# EAGLE design SerialChiller (EAGLE 9.1.3)
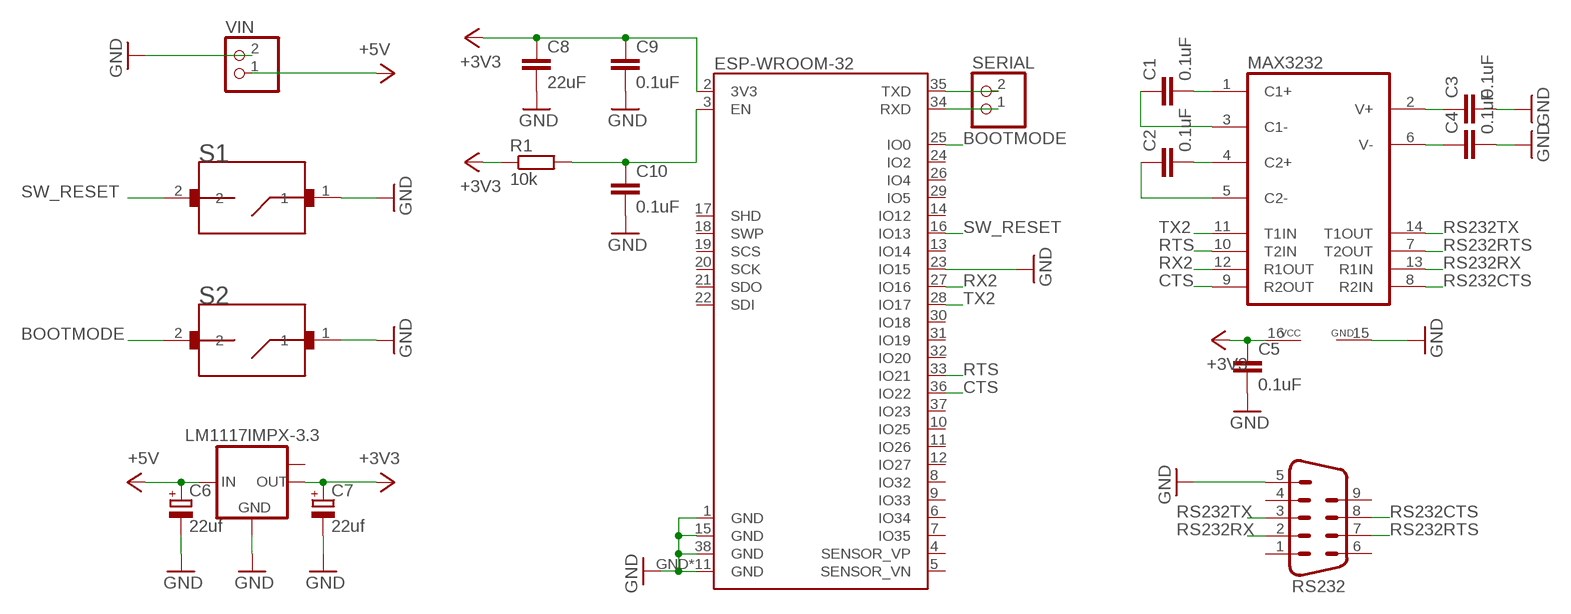
[diagram p0: schematic, sheet 1]

## Parts
C1  0.1uF  C-EUC0603  [C0603]
C2  0.1uF  C-EUC0603  [C0603]
C3  0.1uF  C-EUC0603  [C0603]
C4  0.1uF  C-EUC0603  [C0603]
C5  0.1uF  C-EUC0603  [C0603]
C6  22uf  CPOL-EUA/3216-18R  [A/3216-18R]
C7  22uf  CPOL-EUA/3216-18R  [A/3216-18R]
C8  22uF  C-EUC1206  [C1206]
C9  0.1uF  C-EUC0603  [C0603]
C10  0.1uF  C-EUC0603  [C0603]
ESP-WROOM-32  ESP-WROOM-03  [ESP-WROOM-03]
IC1  LM1117IMPX-3.3  [SOT223]
MAX3232  MAX3232CSE  [SO16]
R1  10k  R-EU_R0603  [R0603]
RS232  M09HP  [M09HP]
S1  B3U-1000P  [SW_B3U-1000P]
S2  B3U-1000P  [SW_B3U-1000P]
SERIAL  Serial  PINHD-1X2  [1X02]
VIN  Power  PINHD-1X2  [1X02]

## Nets
+3V3: C5.1 C7.+ C8.1 C9.1 ESP-WROOM-32.2(3V3) IC1.2(OUT) MAX3232.16(VCC) R1.1
+5V: C6.+ IC1.3(IN) VIN.1
BOOTMODE: ESP-WROOM-32.25(IO0) S2.2
C1+: C1.2 MAX3232.1(C1+)
C1-: C1.1 MAX3232.3(C1-)
C2+: C2.2 MAX3232.4(C2+)
C2-: C2.1 MAX3232.5(C2-)
CTS: ESP-WROOM-32.36(IO22) MAX3232.9(R2OUT)
ENABLE: C10.1 ESP-WROOM-32.3(EN) R1.2
GND: C3.2 C4.2 C5.2 C6.- C7.- C8.2 C9.2 C10.2 ESP-WROOM-32.1(GND) ESP-WROOM-32.15(GND) ESP-WROOM-32.23(IO15) ESP-WROOM-32.38(GND) ESP-WROOM-32.GND ESP-WROOM-32.GND1(GND) ESP-WROOM-32.P$1(GND) ESP-WROOM-32.P$2(GND) ESP-WROOM-32.P$3(GND) ESP-WROOM-32.P$4(GND) ESP-WROOM-32.P$5(GND) ESP-WROOM-32.P$6(GND) ESP-WROOM-32.P$7(GND) ESP-WROOM-32.P$8(GND) ESP-WROOM-32.P$9(GND) IC1.1(GND) MAX3232.15(GND) RS232.5 S1.1 S2.1 VIN.2
RS232CTS: MAX3232.8(R2IN) RS232.8
RS232RTS: MAX3232.7(T2OUT) RS232.7
RS232RX: MAX3232.13(R1IN) RS232.2
RS232TX: MAX3232.14(T1OUT) RS232.3
RTS: ESP-WROOM-32.33(IO21) MAX3232.10(T2IN)
RX1: ESP-WROOM-32.34(RXD) SERIAL.1
RX2: ESP-WROOM-32.27(IO16) MAX3232.12(R1OUT)
SW_RESET: ESP-WROOM-32.16(IO13) S1.2
TX1: ESP-WROOM-32.35(TXD) SERIAL.2
TX2: ESP-WROOM-32.28(IO17) MAX3232.11(T1IN)
VS+: C3.1 MAX3232.2(V+)
VS-: C4.1 MAX3232.6(V-)
Unconnected: ESP-WROOM-32.4(SENSOR_VP) ESP-WROOM-32.5(SENSOR_VN) ESP-WROOM-32.6(IO34) ESP-WROOM-32.7(IO35) ESP-WROOM-32.8(IO32) ESP-WROOM-32.9(IO33) ESP-WROOM-32.10(IO25) ESP-WROOM-32.11(IO26) ESP-WROOM-32.12(IO27) ESP-WROOM-32.13(IO14) ESP-WROOM-32.14(IO12) ESP-WROOM-32.17(SHD) ESP-WROOM-32.18(SWP) ESP-WROOM-32.19(SCS) ESP-WROOM-32.20(SCK) ESP-WROOM-32.21(SDO) ESP-WROOM-32.22(SDI) ESP-WROOM-32.24(IO2) ESP-WROOM-32.26(IO4) ESP-WROOM-32.29(IO5) ESP-WROOM-32.30(IO18) ESP-WROOM-32.31(IO19) ESP-WROOM-32.32(IO20) ESP-WROOM-32.37(IO23) IC1.TAB(OUT1) RS232.1 RS232.4 RS232.6 RS232.9

## Library data of the parts
C1-C5 C8-C10 = rcl:C-EU: CAPACITOR, European symbol
C6 C7 = rcl:CPOL-EU: POLARIZED CAPACITOR, European symbol
ESP-WROOM-32 = esp32:ESP-WROOM-03
IC1 = lm1117:LM1117IMPX-*
MAX3232 = maxim:MAX3232*: True RS-232 Transceivers 3.0V to 5.5V, Low-Power up to 1Mbps, Using Four 0.1µF External Capacitors Source: http://pdfserv.maxim-ic.com/en/ds/MAX3222-MAX3241.pdf; MPN: MAX3232CSE; OC_FARNELL: 9725490; OC_NEWARK: 90C2890
R1 = rcl:R-EU_: RESISTOR, European symbol
RS232 = 56F402-001:M09: SUB-D; OC_FARNELL: unknown; OC_NEWARK: unknown
S1 S2 = B3U-1000P:B3U-1000P: Switch Tactile N.O. SPST Round Button Gull Wing 0.05A 12VDC 1.5N SMD Embossed T/R; AVAILABILITY: Good; DESCRIPTION: Switch Tactile N.O. SPST Round Button Gull Wing 0.05A 12VDC 1.5N SMD Embossed T/R; MF: Omron; MP: B3U-1000P; PACKAGE: None; PRICE: 0.65 USD
SERIAL VIN = pinhead:PINHD-1X2: PIN HEADER

## Board
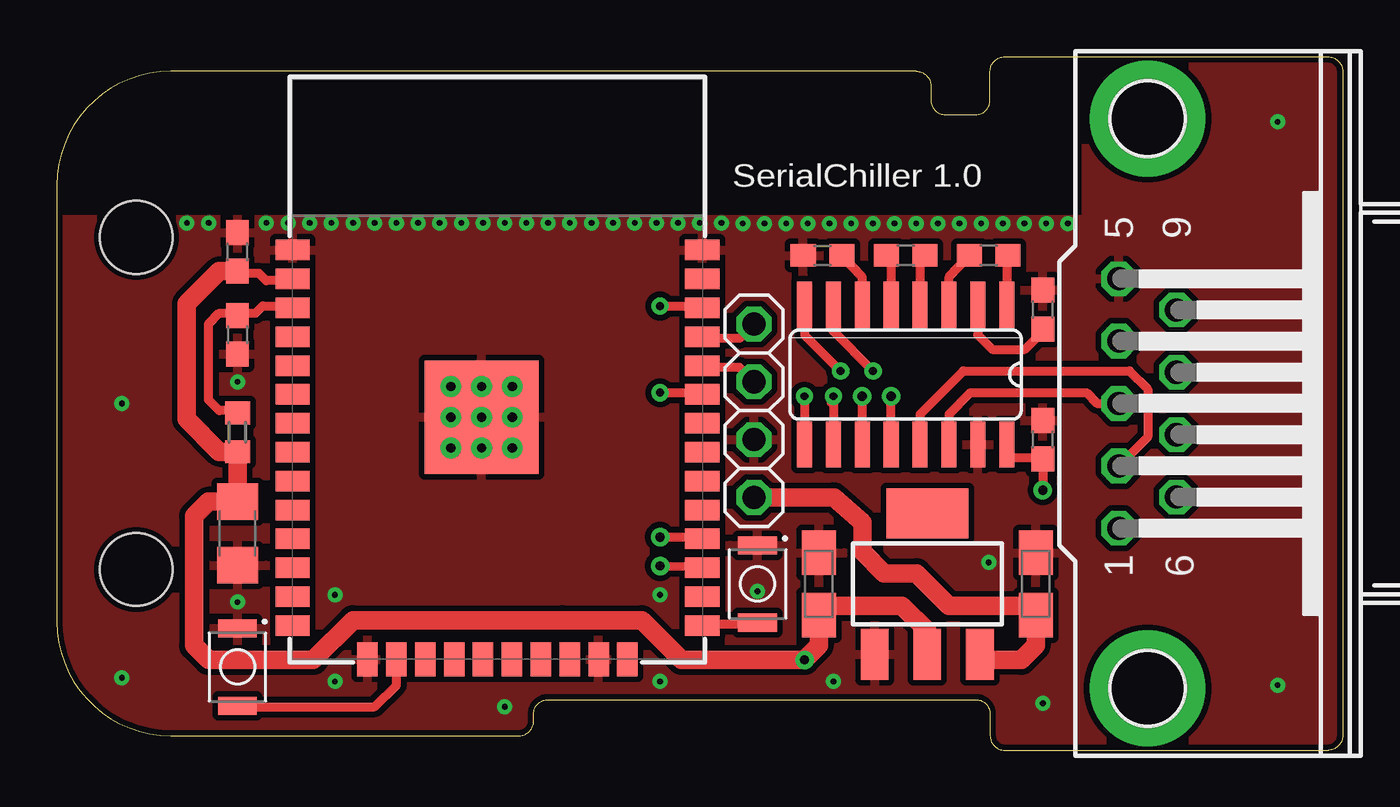
[diagram p1: board, top side]
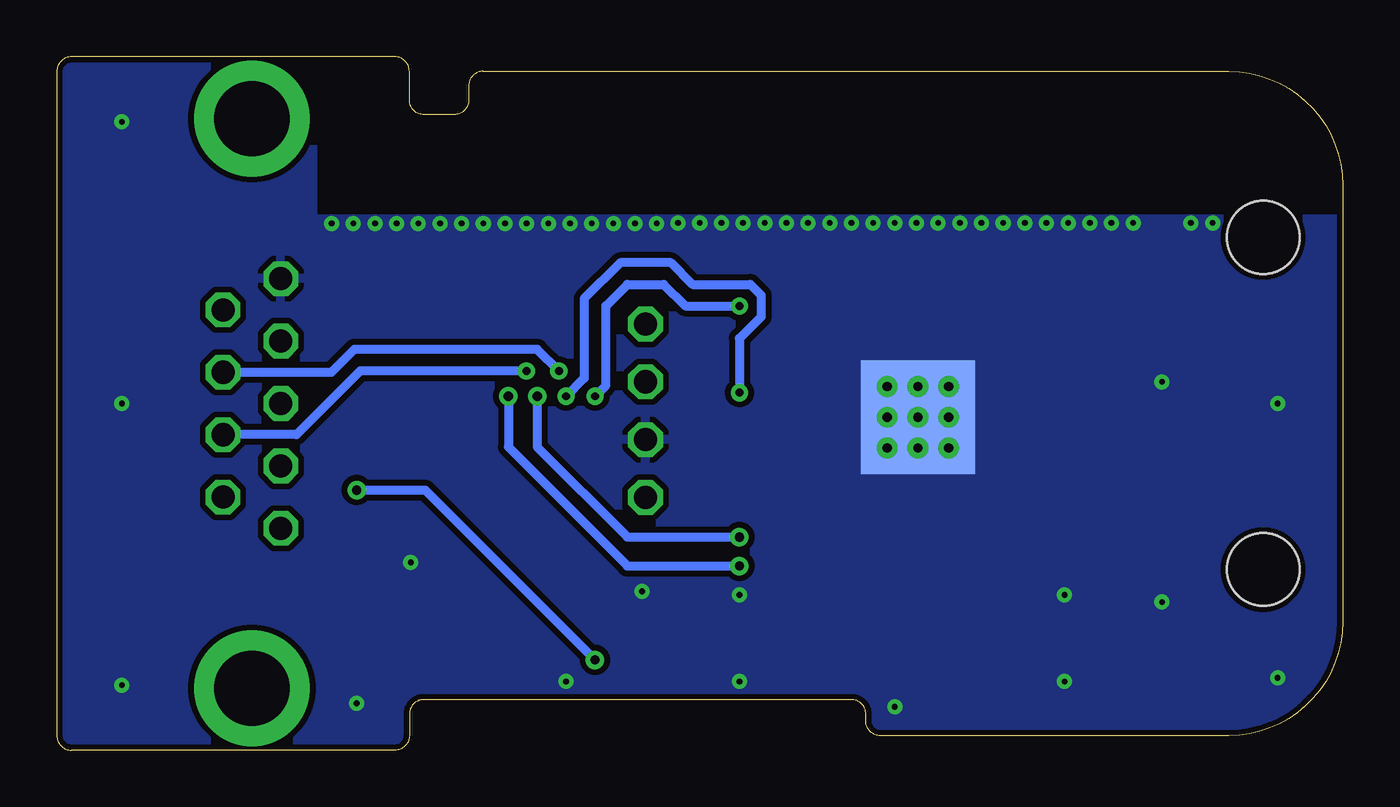
[diagram p2: board, bottom side, seen from below]

Size 56.51 x 30.48 mm. Coordinates in mm from the lower left corner, seen from the top.
Outline: 56.51,29.84 56.51,0.63 arc-90 55.88,0 41.66,0 arc-90 41.02,0.63 41.02,1.59 arc90 40.39,2.22 21.59,2.22 arc90 20.96,1.59 20.96,1.27 arc-90 20.32,0.63 5,0.63 arc-90 0,5.64 0,24.84 arc-90 5,29.84 37.78,29.84 arc-90 38.42,29.21 38.42,28.58 arc90 39.05,27.94 40.39,27.94 arc90 41.02,28.58 41.02,29.84 arc-90 41.66,30.48 55.88,30.48 arc-90 56.51,29.84
Copper layers (1*16): Top 0.035mm / dielectric 1.5mm / Bottom 0.035mm
Design rules "duinodcx *": minimum track width 10mil, minimum drill 10mil, track to track 10mil, track to pad 10mil, pad to pad 10mil, via to via 10mil, smd to smd 10mil, copper to edge 10mil, drill to drill 10mil, minimum pad ring 10mil, minimum via ring 8mil, stop-mask expansion 4mil, vias tented up to drill 16mil, thermal gap 10mil
Holes 3.2 mm at 3.49,22.54 3.49,7.94

### Footprints (pad centres in the part's own frame; a part is rotated, then mirrored left to right if it is on the bottom)
C0603 = smd 1.1 x 1: 1 -0.85,0; 2 0.85,0
A/3216-18R = smd 1.95 x 1.5: + 1.375,0; - -1.375,0
C1206 = smd 1.6 x 1.8: 1 -1.4,0; 2 1.4,0
ESP-WROOM-03 = smd 0.9 x 1.5: 1 7.7,9; 2 6.43,9; 3 5.16,9; 4 3.89,9; 5 2.62,9; 6 1.35,9; 7 0.08,9; 8 -1.19,9; 9 -2.46,9; 10 -3.73,9; 11 -5,9; 12 -6.27,9; 13 -7.54,9; 14 -8.81,9; 25 -8.81,-9; 26 -7.54,-9; 27 -6.27,-9; 28 -5,-9; 29 -3.73,-9; 30 -2.46,-9; 31 -1.19,-9; 32 0.08,-9; 33 1.35,-9; 34 2.62,-9; 35 3.89,-9; 36 5.16,-9; 37 6.43,-9; 38 7.7,-9 | smd 1.5 x 0.9: 15 -10.3,5.715; 16 -10.3,4.445; 17 -10.3,3.175; 18 -10.3,1.905; 19 -10.3,0.635; 20 -10.3,-0.635; 21 -10.3,-1.905; 22 -10.3,-3.175; 23 -10.3,-4.445; 24 -10.3,-5.715 | smd 5 x 5 bottom: GND 0.35,0.7 | smd 5 x 5: GND1 0.35,0.7 | drill 0.406: P$1 -1,2.05; P$2 0.35,2.05; P$3 1.7,2.05; P$4 -1,0.7; P$5 0.35,0.7; P$6 1.7,0.7; P$7 -1,-0.65; P$8 0.35,-0.65; P$9 1.7,-0.65
SOT223 = smd 1.219 x 2.235: 1 -2.311,-3.099; 2 0,-3.099; 3 2.311,-3.099 | smd 3.6 x 2.2: TAB 0,3.099
SO16 = smd 0.66 x 2.032: 1 -4.445,-3.073; 2 -3.175,-3.073; 3 -1.905,-3.073; 4 -0.635,-3.073; 5 0.635,-3.073; 6 1.905,-3.073; 7 3.175,-3.073; 8 4.445,-3.073; 9 4.445,3.073; 10 3.175,3.073; 11 1.905,3.073; 12 0.635,3.073; 13 -0.635,3.073; 14 -1.905,3.073; 15 -3.175,3.073; 16 -4.445,3.073
R0603 = smd 1 x 1.1: 1 -0.85,0; 2 0.85,0
M09HP = drill 1.016 octagon: 1 -5.486,1.27; 2 -2.743,1.27; 3 0,1.27; 4 2.743,1.27; 5 5.486,1.27; 6 -4.115,-1.27; 7 -1.372,-1.27; 8 1.372,-1.27; 9 4.115,-1.27 | drill 3.302 pad 5.08: G1 -12.522,0; G2 12.522,0
SW_B3U-1000P = smd 0.8 x 1.7: 1 -1.7,0; 2 1.7,0
1X02 = drill 1.016 octagon: 1 -1.27,0; 2 1.27,0

### Placement (x,y rotation side)
C1  40.96,21.75 0 top
C2  37.31,21.75 0 top
C3  43.34,19.37 90 top
C4  33.65,21.75 180 top
C5  43.34,13.65 90 top
C6  43.02,7.3 270 top
C7  33.49,7.3 270 top
C8  7.94,9.52 270 top
C9  7.94,21.91 90 top
C10  7.94,18.26 270 top
ESP-WROOM-32  19.37,14.29 90 top
IC1  38.26,7.3 0 top
MAX3232  37.31,16.51 180 top
R1  7.94,13.97 90 top
RS232  47.94,15.24 90 top
S1  7.94,3.65 270 top
S2  30.8,7.3 270 top
SERIAL  30.64,17.46 90 top
VIN  30.64,12.38 90 top

### Tracks (layer width: path | path; a pad name or v marks a point on that pad's centre or on a via)
+3V3  (via drill 0.41)
  Top 0.254: R1.1 | 33.5,5.71 33.65,5.71 C7.+ 33.65,6.35
  Top 0.406: ESP-WROOM-32.2 10.48,20.64 9.21,20.64 8.89,20.95 7.94,20.95 7.3,21.06 | MAX3232.16 41.75,12.86 43.28,12.86 C5.1 v43.34,11.43
  Top 0.813: C9.1 7.3,21.06 7.14,21.06 5.71,19.63 5.71,14.55 7.14,13.12 R1.1 C8.1 6.67,10.93 6.03,10.29 6.03,4.6 6.67,3.97 11.27,3.97 13.02,5.71 22.23,5.71 25.72,5.71 27.46,3.97 v32.86,3.97 33.5,4.6 33.5,5.71 | 33.65,6.35 37.15,6.35 38.26,5.24 IC1.2
  Bottom 0.406: v43.34,11.43 40.32,11.43 v32.86,3.97
+5V
  Top 0.813: VIN.1 34.15,11.11 35.4,10 35.4,8.73 36.35,7.78 37.78,7.78 39.21,6.35 42.7,6.35 | 42.7,6.35 42.71,6.24 C6.+ | 42.7,6.35 43.02,6.35 43.02,4.6 42.39,3.97 40.57,3.97 IC1.3
BOOTMODE
  Top 0.406: S2.2 30.75,5.56 28.45,5.56 ESP-WROOM-32.25
C1+
  Top 0.406: C1.2 41.75,21.75 MAX3232.1
C1-
  Top 0.406: MAX3232.3 39.21,20.8 C1.1
C2+
  Top 0.406: C2.2 37.94,21.75 MAX3232.4
C2-
  Top 0.406: MAX3232.5 36.67,21.53 C2.1
CTS  (via drill 0.35)
  Top 0.406: v32.86,15.56 MAX3232.9 | v26.51,19.53 28.29,19.53 ESP-WROOM-32.36
  Bottom 0.406: v32.86,15.56 32.38,16.03 32.38,19.53 31.43,20.48 29.84,20.48 28.89,19.53 v26.51,19.53
ENABLE
  Top 0.254: 9.84,19.53 9.84,19.68 ESP-WROOM-32.3 | R1.2 7.94,14.84 7.62,14.84 7.62,14.92 | C10.1 7.94,19.21
  Top 0.406: 7.62,14.92 7.14,14.92 6.67,15.4 6.67,18.73 7.14,19.21 7.94,19.21 8.73,19.21 9.05,19.53 9.84,19.53
GND  (via drill 0.25)
  Top 0.254: ESP-WROOM-32.P$1 17.46,13.34 17.46,14.61 ESP-WROOM-32.P$2 | ESP-WROOM-32.P$7 20,13.34 18.73,13.34 ESP-WROOM-32.P$4 | ESP-WROOM-32.P$9 20,15.88 18.73,15.88 ESP-WROOM-32.P$6
  Bottom 0.254: ESP-WROOM-32.GND1 18.1,15.24 17.46,15.88 ESP-WROOM-32.P$3
  other vias: 7.94,16.19 34.13,3.02 2.86,15.24 2.86,3.18 53.66,27.62 53.66,2.86 12.22,6.83 15.88,23.18 23.49,23.18 26.51,6.83 19.68,1.91 53.66,15.24 12.22,3.02 43.34,2.06 7.94,6.51 5.71,23.18 40.96,8.25 30.15,23.16 30.8,6.98 19.68,23.18 17.78,23.18 21.59,23.18 16.83,23.18 18.73,23.18 20.64,23.18 22.54,23.18 24.45,23.18 25.4,23.18 26.35,23.18 27.3,23.18 14.92,23.18 13.97,23.18 13.02,23.18 12.06,23.18 28.26,23.18 29.21,23.18 9.21,23.18 6.67,23.18 31.1,23.16 32.05,23.16 11.11,23.18 10.16,23.18 33.01,23.16 33.96,23.16 34.91,23.16 35.86,23.16 36.82,23.16 37.77,23.16 38.72,23.16 39.67,23.16 40.63,23.16 41.58,23.16 42.53,23.16 43.48,23.16 44.44,23.16 26.51,3.02
  pour Top: 58.1,31.75 58.1,-1.27 -2.54,-1.27 -2.54,23.34 45.24,23.34 45.24,31.91
  pour Bottom: 58.1,-1.27 -3.65,-1.27 -3.65,23.34 45.24,23.34 45.24,31.91 58.1,31.75
RS232CTS  (via drill 0.35)
  Top 0.406: v34.45,16.67 32.86,18.26 MAX3232.8
  Bottom 0.406: v34.45,16.67 35.4,17.62 43.44,17.62 44.45,16.61 RS232.8
RS232RTS  (via drill 0.35)
  Top 0.406: v35.88,16.67 34.13,18.41 MAX3232.7
  Bottom 0.406: v35.88,16.67 43.18,16.67 45.98,13.87 RS232.7
RS232RX
  Top 0.406: RS232.2 47.94,13.77 47.94,15.88 47.15,16.67 39.85,16.67 37.94,14.76 MAX3232.13
RS232TX
  Top 0.406: RS232.3 45.72,15.24 45.24,15.72 40.16,15.72 39.21,14.76 MAX3232.14
RTS  (via drill 0.35)
  Top 0.254: 28.1,15.88 28.26,15.88 ESP-WROOM-32.33 | 34.13,15.26 33.97,15.24 v34.13,15.56
  Top 0.406: 34.13,13.51 | 34.13,13.51 v34.13,15.56 | v26.51,15.72 27.94,15.72 28.1,15.88 | 34.13,13.51 MAX3232.10 | MAX3232.10 | 34.13,15.26
  Bottom 0.406: v34.13,15.56 33.34,16.35 33.34,19.84 31.75,21.43 29.53,21.43 28.57,20.48 26.04,20.48 25.56,20 25.56,19.05 26.51,18.1 v26.51,15.72
RX1
  Top 0.406: SERIAL.1 30,16.83 28.37,16.83 ESP-WROOM-32.34
RX2  (via drill 0.41)
  Top 0.406: MAX3232.12 v36.67,15.56 | v26.51,8.1 28.1,8.09 28.73,8.18 ESP-WROOM-32.27
  Bottom 0.406: v36.67,15.56 36.67,13.34 31.43,8.1 v26.51,8.1
SW_RESET
  Top 0.406: S1.2 7.78,1.91 13.97,1.91 14.92,2.86 ESP-WROOM-32.16
TX1
  Top 0.406: SERIAL.2 30,18.1 28.37,18.1 ESP-WROOM-32.35
TX2  (via drill 0.41)
  Top 0.406: MAX3232.11 v35.4,15.56 | v26.51,9.37 28.26,9.37 28.26,9.21 28.57,9.21 28.28,9.29 ESP-WROOM-32.28
  Bottom 0.406: v35.4,15.56 35.4,13.34 31.43,9.37 v26.51,9.37
VS+
  Top 0.406: MAX3232.2 40.48,18.26 41.12,17.62 42.54,17.62 43.02,18.1 | 43.02,18.1 C3.1 43.18,18.41 43.02,18.1
VS-
  Top 0.406: MAX3232.6 35.4,20.8 C4.1

### Text on the board
tPlace: SerialChiller 1.0